# EAGLE design Puzzle OLED128x32-I2C (EAGLE 6.6.0)
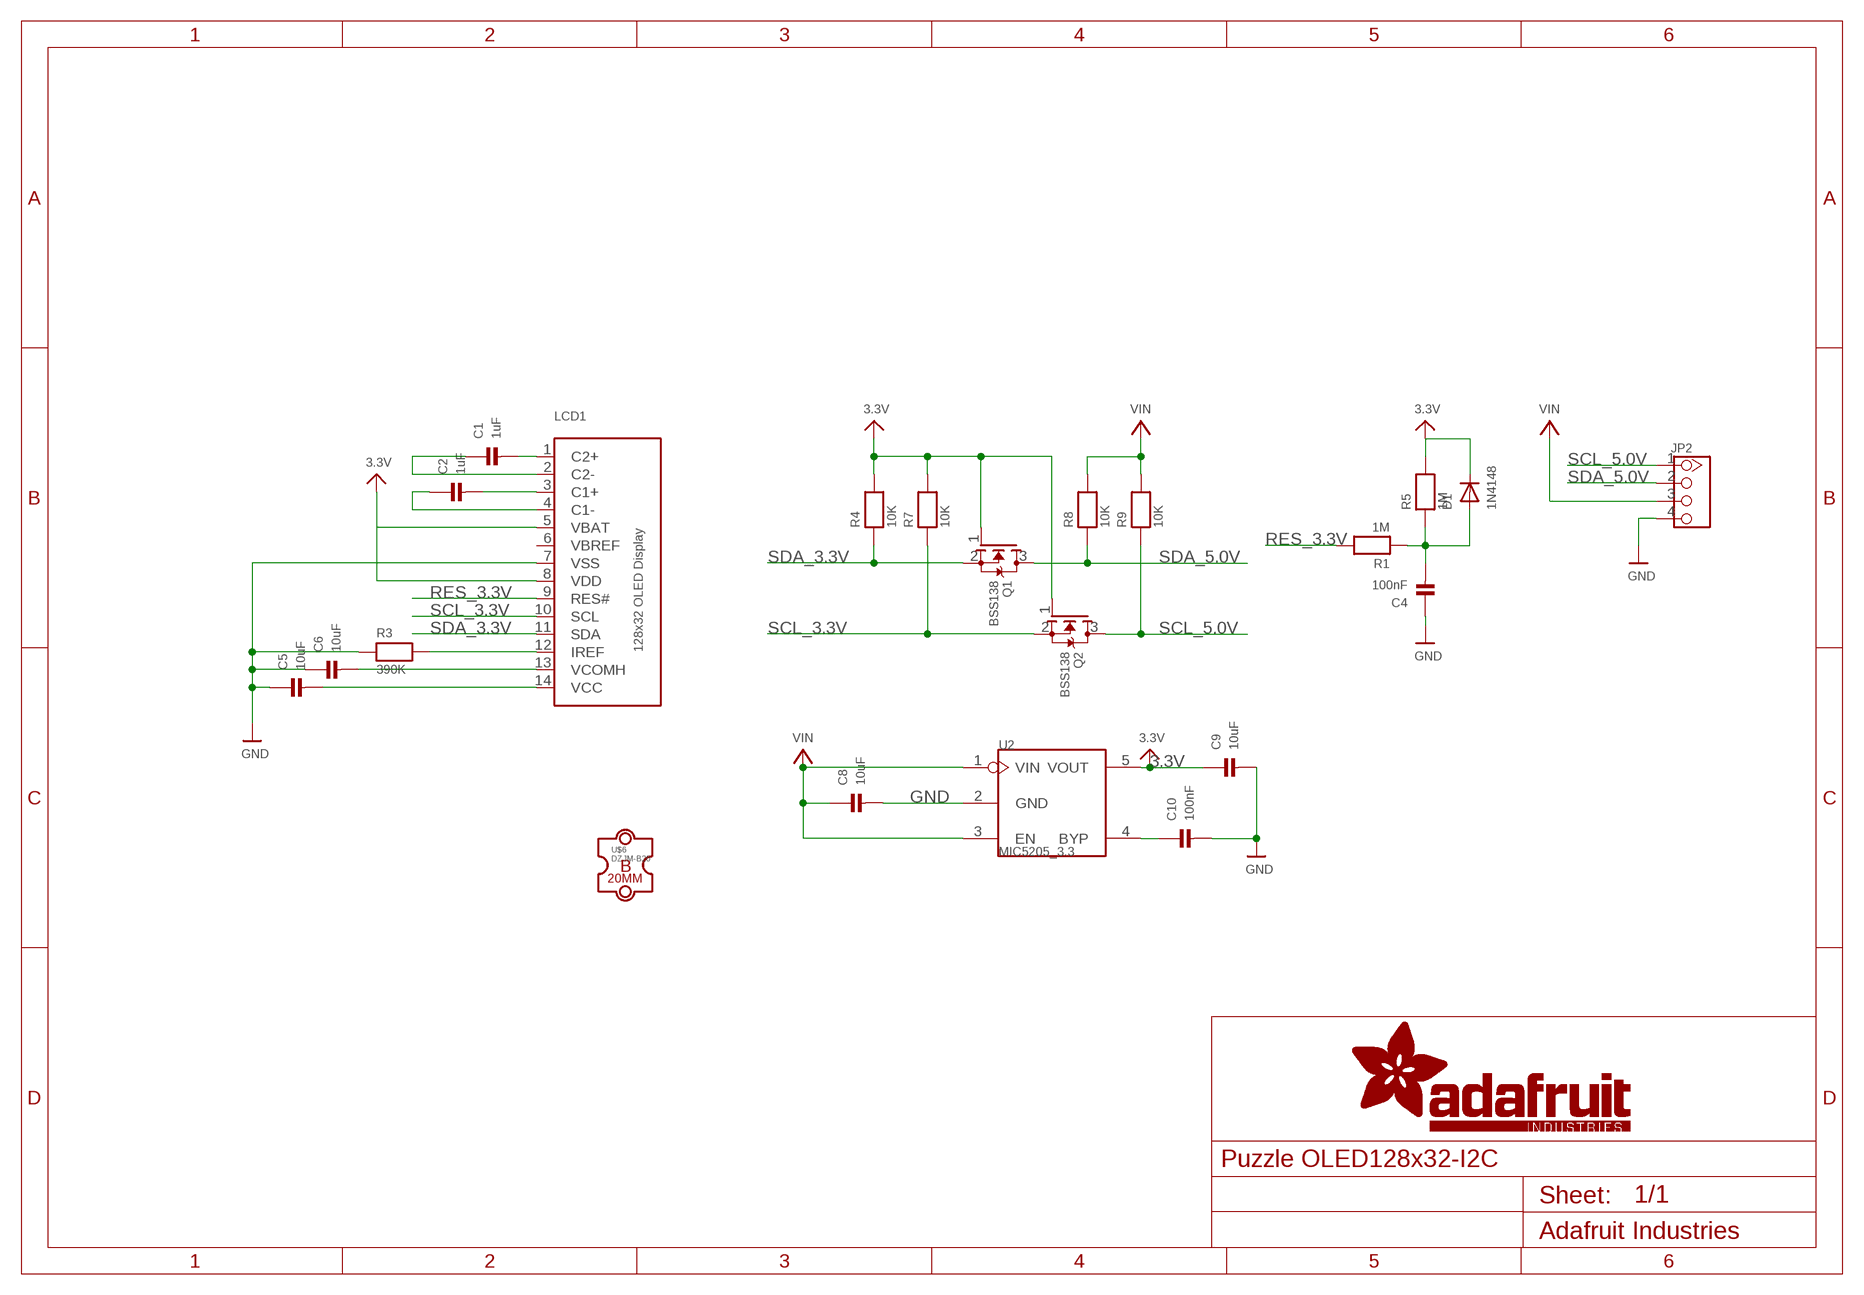
[diagram p0: schematic, sheet 1]

## Parts
C1  1uF  CAP_CERAMIC0603  [0603]
C2  1uF  CAP_CERAMIC0603  [0603]
C4  100nF  CAP_CERAMIC0603  [0603]
C5  10uF  CAP_CERAMIC0805  [0805]
C6  10uF  CAP_CERAMIC0805  [0805]
C8  10uF  CAP_CERAMIC0805  [0805]
C9  10uF  CAP_CERAMIC0805  [0805]
C10  100nF  CAP_CERAMIC0603  [0603]
D1  1N4148  DIODESOD-323F  [SOD-323F]
JP2  M048  [4P-SMD-2.0-90D]
LCD1  DISP_OLED_UG-2832HSWEG02  [UG-2832HSWEG02_WRAPUNDER]
Q1  BSS138  MOSFET-NWIDE  [SOT23-WIDE]
Q2  BSS138  MOSFET-NWIDE  [SOT23-WIDE]
R1  1M  RESISTOR0603  [0603]
R3  390K  RESISTOR0603  [0603]
R4  10K  RESISTOR0805  [0805]
R5  1M  RESISTOR0805  [0805]
R7  10K  RESISTOR0805  [0805]
R8  10K  RESISTOR0805  [0805]
R9  10K  RESISTOR0805  [0805]
U2  MIC5205_3.3  MIC5025_X.X  [SOT23-5]
U$6  DZJM-B20  [DZJM-B20-2P-B]

## Nets
3.3V: C9.1 D1.C LCD1.5(VBAT) LCD1.8(VDD) Q1.1(G) Q2.1(G) R4.2 R5.2 R7.2 U2.5(VOUT)
GND: C4.1 C5.1 C6.1 C8.2 C9.2 C10.2 JP2.4 LCD1.7(VSS) R3.1 U2.2(GND)
N$1: C1.2 LCD1.1(C2+)
N$2: C1.1 LCD1.2(C2-)
N$3: C2.2 LCD1.3(C1+)
N$4: C2.1 LCD1.4(C1-)
N$5: C6.2 LCD1.13(VCOMH)
N$6: C5.2 LCD1.14(VCC)
N$7: LCD1.12(IREF) R3.2
N$8: C10.1 U2.4(BYP)
N$9: C4.2 D1.A R1.1 R5.1
RES_3.3V: LCD1.9(RES#) R1.2
SCL_3.3V: LCD1.10(SCL) Q2.2(S) R7.1
SCL_5.0V: JP2.1 Q2.3(D) R9.1
SDA_3.3V: LCD1.11(SDA) Q1.2(S) R4.1
SDA_5.0V: JP2.2 Q1.3(D) R8.1
VIN: C8.1 JP2.3 R8.2 R9.2 U2.1(VIN) U2.3(EN)

## Power pins joined to a net without a drawn wire
VBREF: LCD1.6(VBREF)

## Library data of the parts
C1 C2 C4-C6 C8-C10 = microbuilder:CAP_CERAMIC: Ceramic Capacitors 0402 - 0402 Surface Mount Capacitors 16pF 50V 5% [Digikey: 445-4899-2-ND] 18pF 50V 5% [Digikey: 490-1281-2-ND] 22pF 50V 5% [Digikey: 490-1283-2-ND] 68pF 50V 5% [Digikey: 490-1289-2-ND] 0.1uF 10V 10% [Digikey: 490-1318-2-ND] 1.0uF 6.3V 10% [Digikey: 490-1320-2-ND] 0603 - 0603 Surface Mount Capacitors 16 pF 50V 5% [Digikey: 445-5051-2-ND] 22 pF 50V [Digikey: PCC220ACVTR-ND] 33 pF 50V 5% [Digikey: 490-1415-1-ND] 56pF 50V 5% [Digikey: 490-1421-1-ND] 220pF 50V 5% [Digikey: 445-1285-1-ND] 680 pF 50V 2200 pF 50V 5% C0G [Digikey: 445-1297-1-ND] 5600 pF 100V 5% X7R [Digikey: 478-3711-1-ND] 0.1 µF 25V 10% [Digikey: PCC2277TR-ND] 0.22 µF 16V 10% X7R [Digikey: 445-1318-1-ND] 1.0 µF 25V 10% [Digikey: 445-5146-2-ND] 0603 - RF Specific 3pF 250V +/-0.1pF RF [Digikey: 712-1347-1-ND] 18 pF 250V 5% [Digikey: 478-3505-1-ND or 712-1322-1-ND] 56 pF 250V 5% C0G RF [Digikey: 490-4867-1-ND] 68 pF 250V RF [Digikey: 490-4868-1-ND] 0805 - 0805 Surface Mount Capacitors 220 pF 250V 2% RF Ceramic Capacitor [Digikey: 712-1398-1-ND] 1000 pF 50V 2% NP0 Ceramic Capacitor [Digikey: 478-3760-1-ND] 0.1 µF 25V 10% Ceramic Capacitor [Digikey: PCC1828TR-ND] 1.0 µF 16V 10% Ceramic Capacitor[Digikey: 490-1691-2-ND] 10.0 µF 10V 10% Ceramic Capacitor[Digikey: 709-1228-1-ND] 10.0 uF 16V 10% Ceramic Capacitor [Digikey: 478-5165-2-ND] 47 uF 6.3V 20% Ceramic Capacitor [Digikey: 587-1779-1-ND or 399-5506-1-ND] 1206 - 1206 Surface Mount Capacitors 47uF 10V 20% Ceramic Capacitor [Digikey: 490-5528-1-ND or 399-5508-1-ND or 445-6010-1-ND] 100uF 6.3V -20%, +80% Y5V Ceramic Capacitor (Digikey: 490-4512-1-ND, Mouser: 81-GRM31CF50J107ZE1L)
D1 = adafruit:DIODE: Diode SMADIODE - SMA Surface Mount Package 20V 1A Schottky Diode Digikey: 641-1014-6-ND DO-1N4148 - Through Hole Small Current Diode SOD-123 20V 1 A (.5mV Vf) Schottky Diode - Digikey: MBRX120TPMSCT-ND SOD-323 10V 570mA (.38mV Vf, 3ns) Schottky Diode - Digikey: ZLLS410CT-ND SOD-523 30V 30mA Schottky Diode (RB751S-40TE61) - Digikey: RB751S-40TE61CT-ND SOT23-R/W - SOT23 Package (R = Solder Paste/Reflow Ovens, W = Hand-Soldering) BAT54Film 40V 300mA - Digikey: 497-7162-1-ND
JP2 = duinofun-connector:M04: Header 4 Standard 4-pin 0.1" header. Use with straight break away headers (SKU : PRT-00116), right angle break away headers (PRT-00553), swiss pins (PRT-00743), machine pins (PRT-00117), and female headers (PRT-00115). Molex polarized connector foot print use with SKU : PRT-08231 with associated crimp pins and housings. 1MM SMD Version SKU: PRT-10208
LCD1 = microbuilder:DISP_OLED_UG-2832HSWEG02: 128x32 I2C 0.91" Monochrome OLED Display
Q1 Q2 = microbuilder:MOSFET-N: N-Channel Mosfet LEGEND VDS: Voltage Drain-Source ID: Drain Current RDS(ON): Drain-Source On-State Resistance VGS(TH): Gate-Source Threshold Voltage CISS: Drain-Source Input Capacitance SOT-23 Name VDS ID RDS(ON) VGS(TH) CISS Order Number 2N7002E 60V 260mA 2.5 Ohm 2.5V @ 250uA 26.7pF @ 25V 2N7002ET1GOSTR-ND BSH103 30V 850mA 400 mOhm 400mV @ 1mA 83pF @ 24V BSH103,235-ND BSS138 60V 320mA 1.6 Ohm 1.5V @ 250uA 50pF @ 10V Mouser: 771-BSS138PW115 * BSS138 good choice for I2C level-shifting
R1 R3-R5 R7-R9 = microbuilder:RESISTOR: Resistors 0402 - 0402 Surface Mount Package 22 Ohm 1% 1/16W [Digikey: 311-22.0LRTR-ND] 33 Ohm 5% 1/16W 1.0K 5% 1/16W 1.5K 5% 1/16W 2.0K 1% 1/16W 10.0K 1% 1/16W [Digikey: 311-10.0KLRTR-ND] 10.0K 5% 1/16W [Digikey: RMCF0402JT10K0TR-ND] 12.1K 1% 1/16W [Digikey: 311-22.0LRTR-ND] 100.0K 5% 1/16W 0603 - 0603 Surface Mount Package 0 Ohm 1/10 Watt 1% Resistor 15 Ohm 1/10 Watt 1% Resistor 33 Ohm 1/10 Watt 1% Resistor 49.9 Ohm 1/10 Watt 1% Resistor 100 Ohm 1/10 Watt 1% Resistor 150 Ohm 1/10 Watt 1% Resistor 240 Ohm 1/10 Watt 1% Resistor 390 Ohm 1/10 Watt 1% Resistor 560 Ohm 1/10 Watt 1% Resistor 680 Ohm 1/10 Watt 1% Resistor 750 Ohm 1/10 Watt 1% Resistor 1.0K Ohm 1/10 Watt 1% Resistor 1.5K Ohm 1/10 Watt 1% Resistor 2.0K Ohm 1/10 Watt 1% Resistor 2.2K Ohm 1/10 Watt 1% Resistor 3.3K Ohm 1/10 Watt 1% Resistor 4.7K Ohm 1/10 Watt 1% Resistor 10.0K Ohm 1/10 Watt 1% Resistor 12.0K Ohm 1/10 Watt 1% Resistor 12.1K Ohm 1/10 Watt 1% Resistor 20.0K Ohm 1/10 Watt 1% Resistor 33.0K Ohm 1/10 Watt 1% Resistor 100.0K Ohm 1/10 Watt 1% Resistor 0805 - 0805 Surface Mount Package 0 Ohm 1/8 Watt 1% Resistor 33 Ohm 1/8 Watt 1% Resistor 100 Ohm 1/8 Watt 1% Resistor 150 Ohm 1/8 Watt 1% Resistor 200 Ohm 1/8 Watt 1% Resistor 240 Ohm 1/8 Watt 1% Resistor 330 Ohm 1/8 Watt 1% Resistor 390 Ohm 1/8 Watt 1% Resistor 470 Ohm 1/8 Watt 1% Resistor 1.0K Ohm 1/8 Watt 1% Resistor 1.5K Ohm 1/8 Watt 1% Resistor 2.0K Ohm 1/8 Watt 1% Resistor 4.7K Ohm 1/8 Watt 1% Resistor 5.1K Ohm 1/8 Watt 1% Resistor 5.6K Ohm 1/8 Watt 1% Resistor 10.0K Ohm 1/8 Watt 1% Resistor 22.0K Ohm 1/8 Watt 1% Resistor 33.0K Ohm 1/8 Watt 1% Resistor 100K Ohm 1/8 Watt 1% Resistor 1206 - 1206 Surface Mount Package 2012 - 2010 Surface Mount Package 0.11 Ohm 1/2 Watt 1% Resistor - Digikey: RHM.11UCT-ND
U2 = ICs_v54:MIC5025_X.X
U$6 = duinofun-outline:DZJM-B20

## Net classes
0 default: width 0.203 mm, drill 0.305 mm, clearance 0.203 mm

## Board
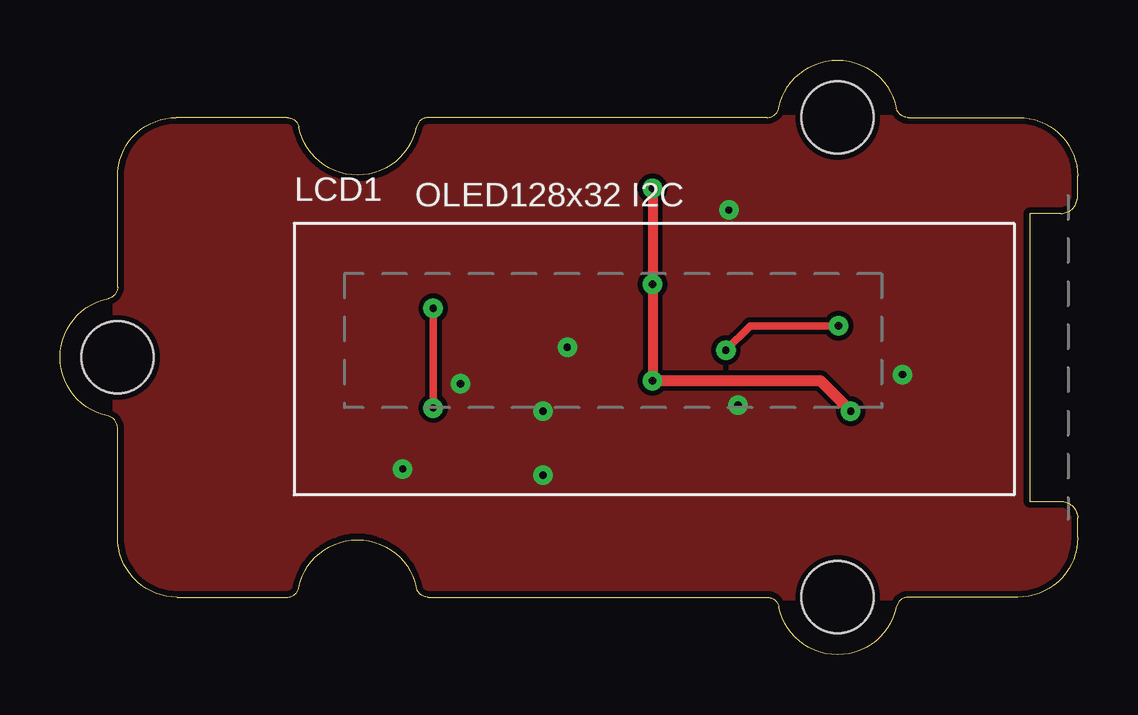
[diagram p1: board, top side]
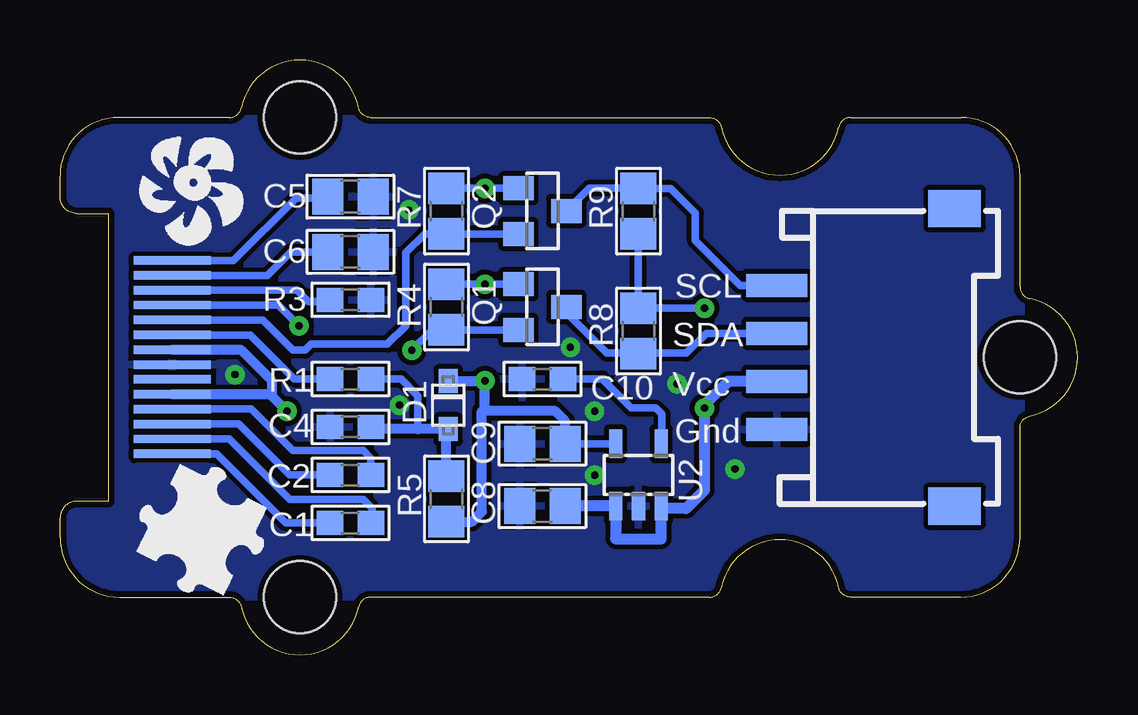
[diagram p2: board, bottom side, seen from below]

Size 42.4 x 24.8 mm. Coordinates in mm from the lower left corner, seen from the top.
Copper layers (1*16): Top 0.035mm / dielectric 1.5mm / Bottom 0.035mm
Design rules "Sparkfun *": minimum track width 12mil, minimum drill 8mil, track to track 8mil, track to pad 8mil, pad to pad 8mil, via to via 8mil, smd to smd 8mil, copper to edge 10mil, drill to drill 8mil, minimum pad ring 12mil, minimum via ring 10mil, stop-mask expansion 4mil, vias tented up to drill 25mil, thermal gap 10mil

### Footprints (pad centres in the part's own frame; a part is rotated, then mirrored left to right if it is on the bottom)
0603 = smd 1.1 x 1: 1 -0.85,0; 2 0.85,0
0805 = smd 1.3 x 1.5: 1 -0.95,0; 2 0.95,0
SOD-323F = smd 1 x 0.8: A -1,0; C 1,0
4P-SMD-2.0-90D = smd 0.965 x 2.54: 1 -3,0; 2 -1,0; 3 1,0; 4 3,0 | smd 1.55 x 2.184: SS1 -6.2,7.4; SS2 6.2,7.4
UG-2832HSWEG02_WRAPUNDER = smd 3.2 x 0.35 bottom: 1 -2.03,-4.03; 2 -2.03,-3.41; 3 -2.03,-2.79; 4 -2.03,-2.17; 5 -2.03,-1.55; 6 -2.03,-0.93; 7 -2.03,-0.31; 8 -2.03,0.31; 9 -2.03,0.93; 10 -2.03,1.55; 11 -2.03,2.17; 12 -2.03,2.79; 13 -2.03,3.41; 14 -2.03,4.03
SOT23-WIDE = smd 1 x 1.27: 1 -0.95,-1; 2 0.95,-1; 3 0,1
SOT23-5 = smd 0.55 x 1.2: 1 -0.95,-1.3; 2 0,-1.3; 3 0.95,-1.3; 4 0.95,1.3; 5 -0.95,1.3
DZJM-B20-2P-B = hole 3: 10,-10; 10,10; -20,0

### Placement (x,y rotation side)
C1  30.3,5.5 180 bottom
C2  30.3,7.5 180 bottom
C4  30.3,9.5 0 bottom
C5  30.3,19.1 180 bottom
C6  30.3,16.8 180 bottom
C8  22.3,6.2 180 bottom
C9  22.3,8.8 180 bottom
C10  22.3,11.5 180 bottom
D1  26.22,10.41 90 bottom
JP2  12.53,12.4 270 bottom
LCD1  39.75,12.41 0 top
Q1  22.3,14.5 270 bottom
Q2  22.3,18.5 270 bottom
R1  30.3,11.5 180 bottom
R3  30.3,14.8 180 bottom
R4  26.3,14.5 90 bottom
R5  26.3,6.5 270 bottom
R7  26.3,18.5 90 bottom
R8  18.3,13.5 90 bottom
R9  18.3,18.5 270 bottom
U2  18.3,7.5 0 bottom
U$4  [DUINOFUN-LOGO-PCB-0.6]  34.73,17.02 90 bottom
U$6  22.4,12.4 0 top
U$7  [BRICK-LOGO-2-B-MIL-0.6]  33.46,2.16 0 top

### Tracks (layer width: path | path; a pad name or v marks a point on that pad's centre or on a via)
3.3V  (via drill 0.3)
  Top 0.406: v24.69,19.45 v24.69,15.45 v24.69,11.43
  Top 0.457: v24.69,11.43 31.68,11.43 v32.95,10.16
  Bottom 0.305: Q1.1 v24.69,15.45 R4.2 | U2.5 C9.1 | C9.1 | R7.2 v24.69,19.45 Q2.1 | 24.69,11.41 v24.69,11.43 | 24.82,10.16 24.69,10.16 | 33.58,10.8 v32.95,10.16
  Bottom 0.406: 35.51,12.72 LCD1.8 34.87,12.72 33.58,11.43 33.58,10.8 | LCD1.5 33.65,10.86 v32.95,10.16 | C9.1 21.35,9.74 21.77,10.16 24.69,10.16 v24.69,11.43 | R5.2 25.24,5.55 24.82,5.97 24.82,10.16 | D1.C 24.69,11.41
GND  (via drill 0.3)
  other vias: 35.11,11.68 14.28,7.75 16.69,11.3 28.25,10.41 20.12,10.16 20.12,7.49 21.14,12.83 27.87,18.54
  pour Bottom: 2.34,2.41 25.2,2.41 42.35,2.41 42.35,8 42.35,22.35 37.77,22.35 2.34,22.35 2.34,6.6 2.34,6.48
  pour Top: 2.34,2.41 25.2,2.41 42.35,2.41 42.35,8 42.35,22.35 37.77,22.35 2.34,22.35 2.34,6.6 2.34,6.48
N$1
  Bottom 0.305: LCD1.1 35.87,8.38 32.99,5.5 C1.2
N$2
  Bottom 0.305: C1.1 29.39,5.56 29.39,6.1 29.77,6.48 32.82,6.48 35.34,9 LCD1.2
N$3
  Bottom 0.305: C2.2 32.83,7.5 34.95,9.62 LCD1.3
N$4
  Bottom 0.305: C2.1 29.45,8.19 29.77,8.51 32.69,8.51 34.42,10.24 LCD1.4
N$5
  Bottom 0.305: LCD1.13 33.76,15.82 32.78,16.8 C6.2
N$6
  Bottom 0.305: LCD1.14 35.18,16.44 32.57,19.05 31.3,19.05 C5.2
N$7
  Bottom 0.305: LCD1.12 32.53,15.2 32.06,14.73 31.22,14.73 R3.2
N$8
  Bottom 0.305: C10.1 19.81,11.5 18.6,10.29 17.58,10.29 17.33,10.03 17.33,8.82 U2.4
N$9
  Bottom 0.305: 29.36,9.41 C4.2 | 26.3,9.33 D1.A | R1.1 28.19,11.5 27.49,10.8 27.49,9.41
  Bottom 0.406: D1.A 27.49,9.41 29.36,9.41 | R5.1 26.3,9.33
RES_3.3V
  Bottom 0.305: LCD1.9 34.48,13.34 32.64,11.5 R1.2
SCL_3.3V
  Bottom 0.305: LCD1.10 33.95,13.96 32.69,12.7 32.19,12.7 31.93,12.95 28.76,12.95 27.99,13.72 27.99,16.76 27.21,17.55 R7.1 Q2.2
SCL_5.0V
  Bottom 0.305: JP2.1 14.06,15.4 15.93,17.27 15.93,18.42 16.95,19.43 18.28,19.43 R9.1 20.35,19.45 Q2.3
SDA_3.3V  (via drill 0.3)
  Top 0.305: v32.44,13.72 28.76,13.72 v27.74,12.7
  Bottom 0.305: LCD1.11 33.3,14.58 v32.44,13.72 | v27.74,12.7 26.89,13.55 R4.1 Q1.2
SDA_5.0V
  Bottom 0.305: JP2.2 15.48,13.4 16.31,12.57 18.28,12.57 R8.1 18.32,12.57 19.61,12.57 21.3,14.26 Q1.3
VIN  (via drill 0.3)
  Top 0.305: v15.55,14.45 v15.55,10.29
  Bottom 0.305: R9.2 R8.2 v15.55,14.45 | 19.25,4.85 19.23,4.83 | C8.1
  Bottom 0.457: JP2.3 14.56,11.4 15.55,10.41 v15.55,10.29 15.55,6.86 16.31,6.1 17.25,6.1 U2.3 17.35,4.83 19.23,4.83 | 19.25,4.85 U2.1 C8.1

### Text on the board
tPlace: OLED128x32 I2C
bPlace: SCL | SDA | Vcc | Gnd